# Altium schematic sheet Isolated Comms - AMS.SchDoc
size A; ProAuthor: William Jupp; Version: V1.0
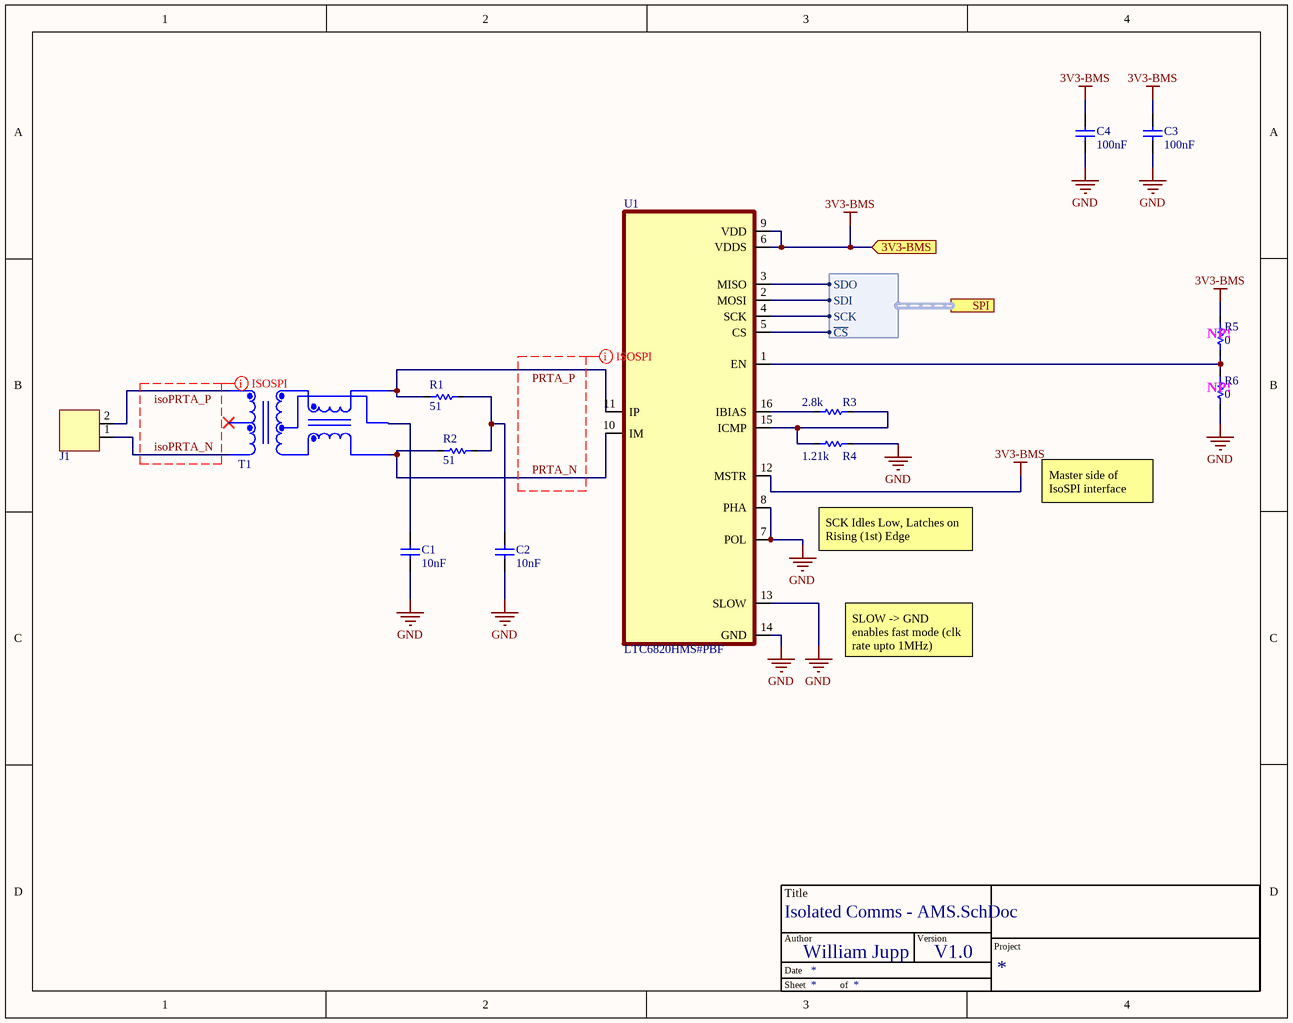
[diagram p0: Isolated Comms - AMS.SchDoc]

## Parts
*  TitleBlock  (value not drawn)  (graphical)
C1  value 10nF  [C_0603]  (hidden comment: 06035C103KAT4A)
C2  value 10nF  [C_0603]  (hidden comment: 06035C103KAT4A)
C3  value 100nF  [C_0603]  (hidden comment: C0603C104K3RAC7013)
C4  value 100nF  [C_0603]  (hidden comment: C0603C104K3RAC7013)
J1  3-794632-2  [3-794632-2]  (value not drawn)
R1  value 51  [R-0603]  (hidden comment: CRCW060351R0JNEA)
R2  value 51  [R-0603]  (hidden comment: CRCW060351R0JNEA)
R3  value 2.8k  [R-0603]  (hidden comment: RC0603FR-072K8L)
R4  value 1.21k  [R-0603]  (hidden comment: AC0603FR-071K21L)
R5  value 0  [R-0603]  (hidden comment: AC0603JR-100RL)
R6  value 0  [R-0603]  (hidden comment: AC0603JR-100RL)
T1  SM91502ALE  [SM91502ALE]  (value not drawn)
U1  LTC6820HMS#PBF  [MSOP-16_MS]

## Ports
3V3-BMS (in), SPI (harness SPI)

## Harnesses
SPI: SDI, SDO, ~{CS}, SCK

## Nets
3V3-BMS: C3.2 C4.2 R5.2 U1.6(VDDS) U1.9(VDD) U1.12(MSTR) ; port 3V3-BMS
GND: C1.1 C2.1 C3.1 C4.1 R4.2 R6.1 U1.7(POL) U1.8(PHA) U1.13(SLOW) U1.14(GND)
isoPRTA_N: J1.1 T1.3
isoPRTA_P: J1.2 T1.1
PRTA_N: R2.1 T1.4 U1.10(IM)
PRTA_P: R1.1 T1.6 U1.11(IP)
NetC1_2: C1.2 T1.5
NetC2_2: C2.2 R1.2 R2.2
NetR3_1: R3.1 U1.16(IBIAS)
NetR3_2: R3.2 R4.1 U1.15(ICMP)
NetR5_1: R5.1 R6.2 U1.1(EN)
NetU1_2: U1.2(MOSI) ; port SPI.SDI
NetU1_3: U1.3(MISO) ; port SPI.SDO
NetU1_4: U1.4(SCK) ; port SPI.SCK
NetU1_5: U1.5(CS) ; port SPI.~{CS}

Not connected (* = marked no-connect by the designer): T1 2*

## Layout directives
differential pair; differential pair class ISO_SPI: isoPRTA_N, isoPRTA_P, PRTA_N, PRTA_P

## Notes on the sheet
- (near R5) NP!
- (near R6) NP!
- Master side of IsoSPI interface
- SCK Idles Low, Latches on Rising (1st) Edge
- SLOW -> GND enables fast mode (clk rate upto 1MHz)
- (in symbol TitleBlock) Title; Author; Version; Project; Date; Sheet; of

## Library data of the parts
C1-C4 = Capacitor: ComponentLink1Description: New link; ComponentLink1URL: *
J1 = 3-794632-2: Micro MATE-N-LOK, Rectangular Power Connectors, Header, Plug, Wire-to-Board, 2 Position
R1-R4 = Resistor
R5 R6 = Resistor: NP
T1 = SM91502ALE: BMS XFORMER 1-CH 1000V AECQ +125; Manufacturer: Bourns; Inductance: 150uH; Turns Ratio: 1:1; Supplier 1: RSComponents; Manufacturer Part Number: SM91502ALE; RoHS: Yes; Category: Transformers; Stock 1: 1; Pricing 1: 800=2.35100 (USD); Mount: Surface Mount; Min Operating Temperature: -40°C; Max Operating Temperature: 125°C; Packaging: Cut Tape; ComponentLink1URL: https://www.bourns.com/docs/Product-Datasheets/SM91502AL.pdf?src-supplier=Digi-Key; ComponentLink1Description: https://www.bourns.com/docs/Product-Datasheets/SM91502AL.pdf?src-supplier=Digi-Key; Supplier Part Number 1: 1802382
U1 = LTC6820HMS#PBF: IC COMM INTERFACE ISOSPI 16MSOP; Manufacturer: Analog Devices / Linear Technology; MF: {'manufacturer': u'Analog Devices Inc.'}; Interface: SPI; Min Supply Voltage: 2.7V; Max Supply Voltage: 5.5V; Availability: Unavailable; Price: None; Package: None; MP: LTC6820HMS#PBF; Value: *; Supplier 1: Mouser; Manufacturer Part Number: LTC6820HMS#PBF; RoHS: Yes; Category: Interface ICs; Pricing 1: 1=6.860000, 10=6.160000, 25=5.820000, 50=5.820000, 100=5.040000, 1000=4.780000, 10000=4.780000 (USD); Case/Package: MSOP; Number of Pins: 16; Min Operating Temperature: -40°C; Max Operating Temperature: 125°C; Package Quantity: 37; Packaging: Rail/Tube; Series: isoSPI; REACH SVHC: No SVHC; RoHS Compliant: Yes; ComponentLink1URL: https://datasheet.ciiva.com/22649/1730562-22649441.pdf?src-supplier=Element14; ComponentLink1Description: https://datasheet.ciiva.com/22649/1730562-22649441.pdf?src-supplier=Element14; ComponentLink2URL: https://datasheet.ciiva.com/6573/42317-6573703.pdf?src-supplier=Digi-Key; ComponentLink2Description: https://datasheet.ciiva.com/6573/42317-6573703.pdf?src-supplier=Digi-Key; ComponentLink3URL: https://datasheet.ciiva.com/22767/1730562-22767675.pdf?src-supplier=Farnell; ComponentLink3Description: https://datasheet.ciiva.com/22767/1730562-22767675.pdf?src-supplier=Farnell; Supplier Part Number 1: 584-LTC6820HMS#PBF